# EAGLE schematic Decoder (EAGLE 9.6.2)
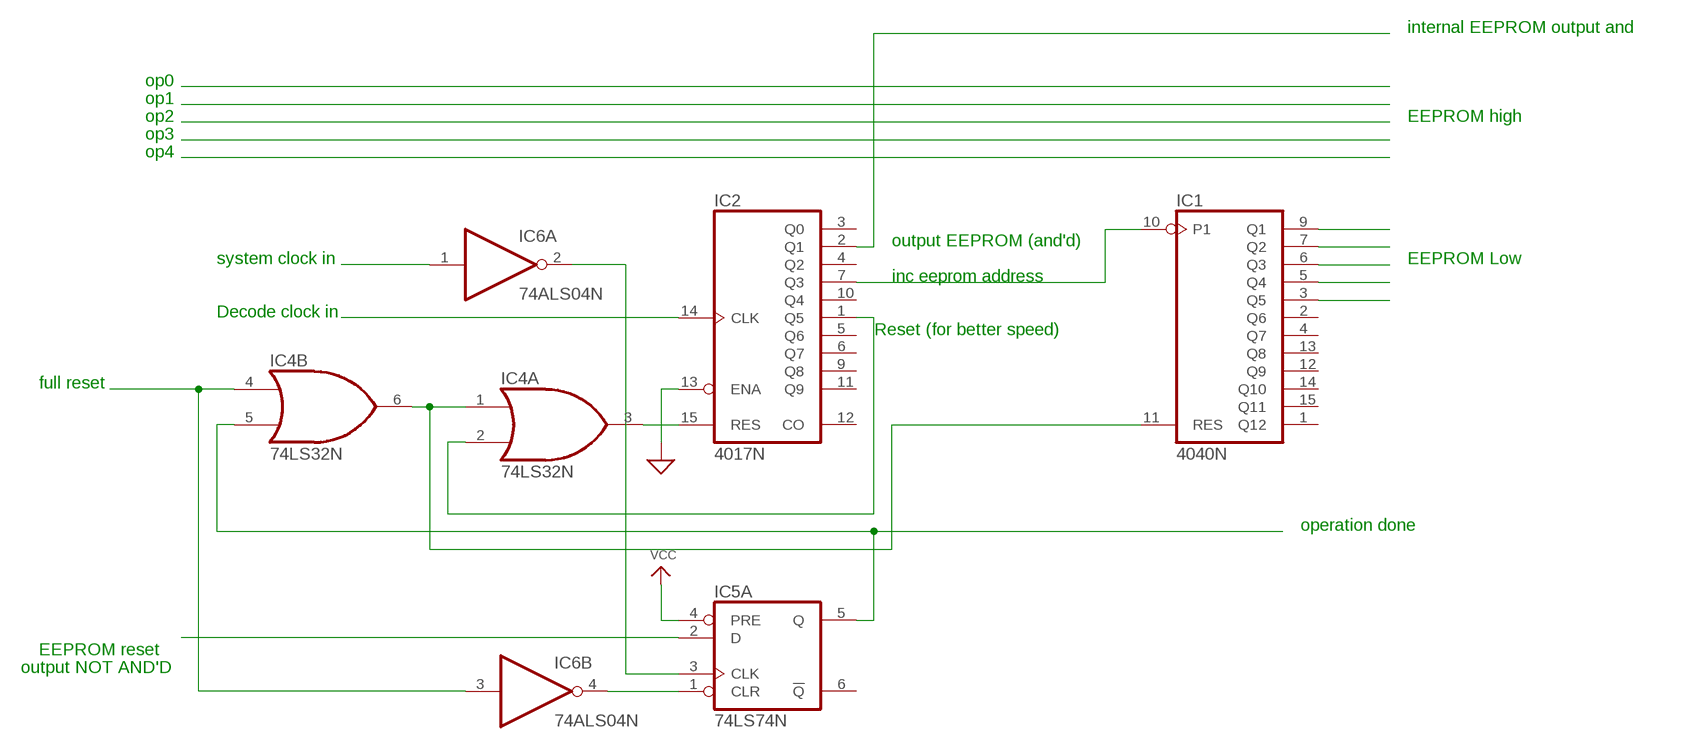
[diagram p0: schematic, sheet 1]

## Parts
IC1  4040N  [DIL16]
IC2  4017N  [DIL16]
IC4  74LS32N  [DIL14]
IC5  74LS74N  [DIL14]
IC6  74ALS04N  [DIL14]

## Nets
GND: IC2.13(ENA) ; supply symbol labelled SUP
N$1: IC2.2(Q1)
N$2: IC1.10(P1) IC2.7(Q3)
N$3: IC1.9(Q1)
N$4: IC1.7(Q2)
N$5: IC1.6(Q3)
N$6: IC1.5(Q4)
N$7: IC1.3(Q5)
N$8: IC2.1(Q5) IC4.2(A:I1)
N$9: IC2.15(RES) IC4.3(A:O)
N$10: IC2.14(CLK)
N$11: IC1.11(RES) IC4.1(A:I0) IC4.6(B:O)
N$12: IC5.3(A:CLK) IC6.2(A:O)
N$13: IC4.5(B:I1) IC5.5(A:Q)
N$14: IC4.4(B:I0) IC6.3(B:I)
N$20: IC5.2(A:D)
N$21: IC6.1(A:I)
N$22: IC5.1(A:CLR) IC6.4(B:O)
VCC: IC5.4(A:PRE)
Unconnected: IC1.1(Q12) IC1.2(Q6) IC1.4(Q7) IC1.12(Q9) IC1.13(Q8) IC1.14(Q10) IC1.15(Q11) IC2.3(Q0) IC2.4(Q2) IC2.5(Q6) IC2.6(Q7) IC2.9(Q8) IC2.10(Q4) IC2.11(Q9) IC2.12(CO) IC4.8(C:O) IC4.9(C:I0) IC4.10(C:I1) IC4.11(D:O) IC4.12(D:I0) IC4.13(D:I1) IC5.6(A:!Q) IC5.8(B:!Q) IC5.9(B:Q) IC5.10(B:PRE) IC5.11(B:CLK) IC5.12(B:D) IC5.13(B:CLR) IC6.5(C:I) IC6.6(C:O) IC6.8(D:O) IC6.9(D:I) IC6.10(E:O) IC6.11(E:I) IC6.12(F:O) IC6.13(F:I)

## Notes on the sheet
- internal EEPROM output and
- op0
- op1
- op2 | EEPROM high
- op3
- op4
- output EEPROM (and'd)
- system clock in | EEPROM Low
- inc eeprom address
- Decode clock in
- Reset (for better speed)
- full reset
- operation done
- EEPROM reset
- output NOT AND'D

## Power pins joined to a net without a drawn wire
GND: IC4.7(P:GND) IC5.7(P:GND) IC6.7(P:GND)
VCC: IC4.14(P:VCC) IC5.14(P:VCC) IC6.14(P:VCC)
VDD: IC1.16(VDD) IC2.16(VDD)
VSS: IC1.8(VSS) IC2.8(VSS)

## Library data of the parts
IC1 = 40xx:4040: 12-stage binary/ripple COUNTER
IC2 = 40xx:4017: COUNTER/DIVIDER
IC4 = 74xx-us:74*32: Quad 2-input OR gate
IC5 = 74xx-us:74*74: Dual D type positive edge triggered FLIP FLOP, preset and clear
IC6 = 74xx-us:74*04: Hex INVERTER